# EAGLE board console-ifc (EAGLE 7.6.0)
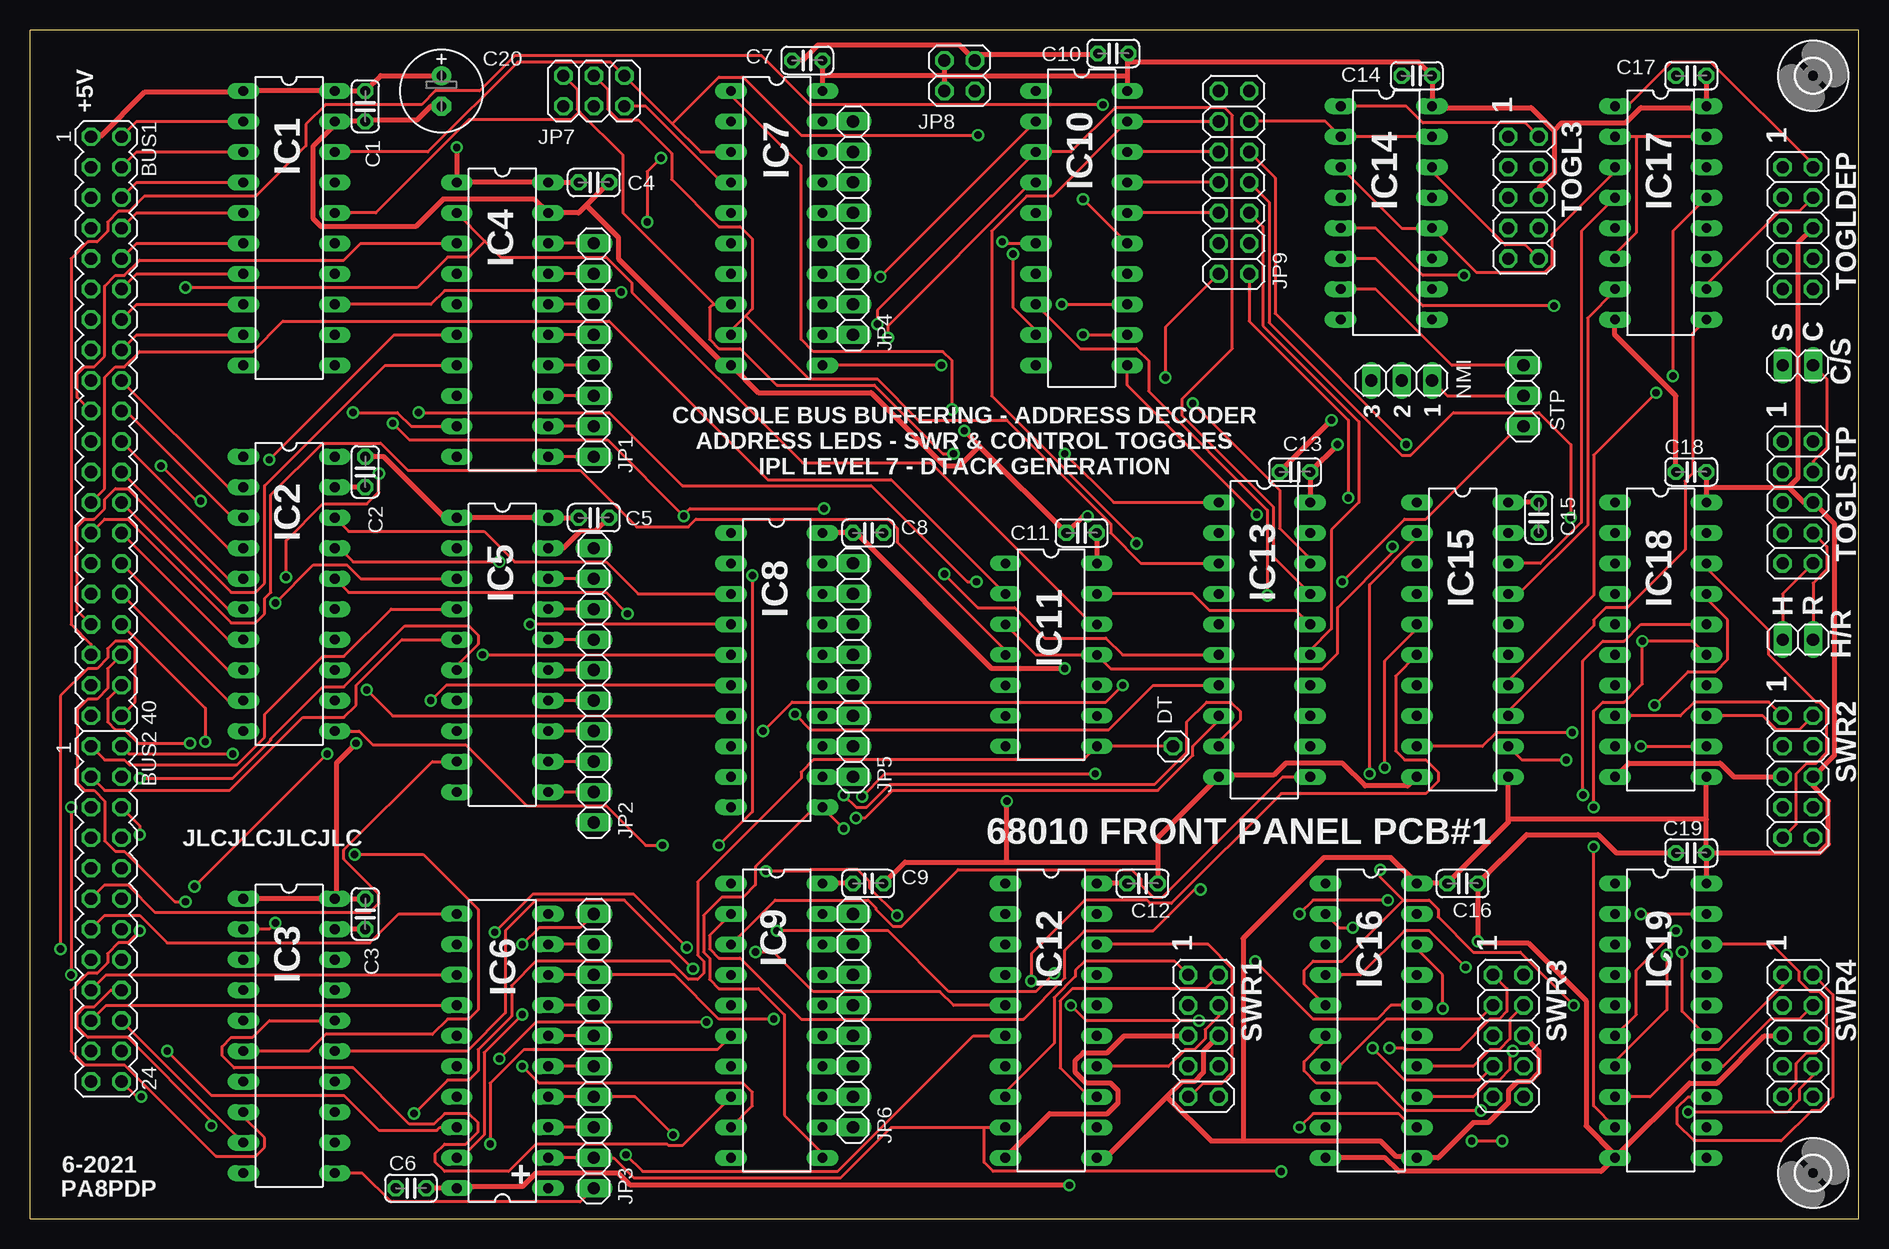
[diagram p4: board, top side]
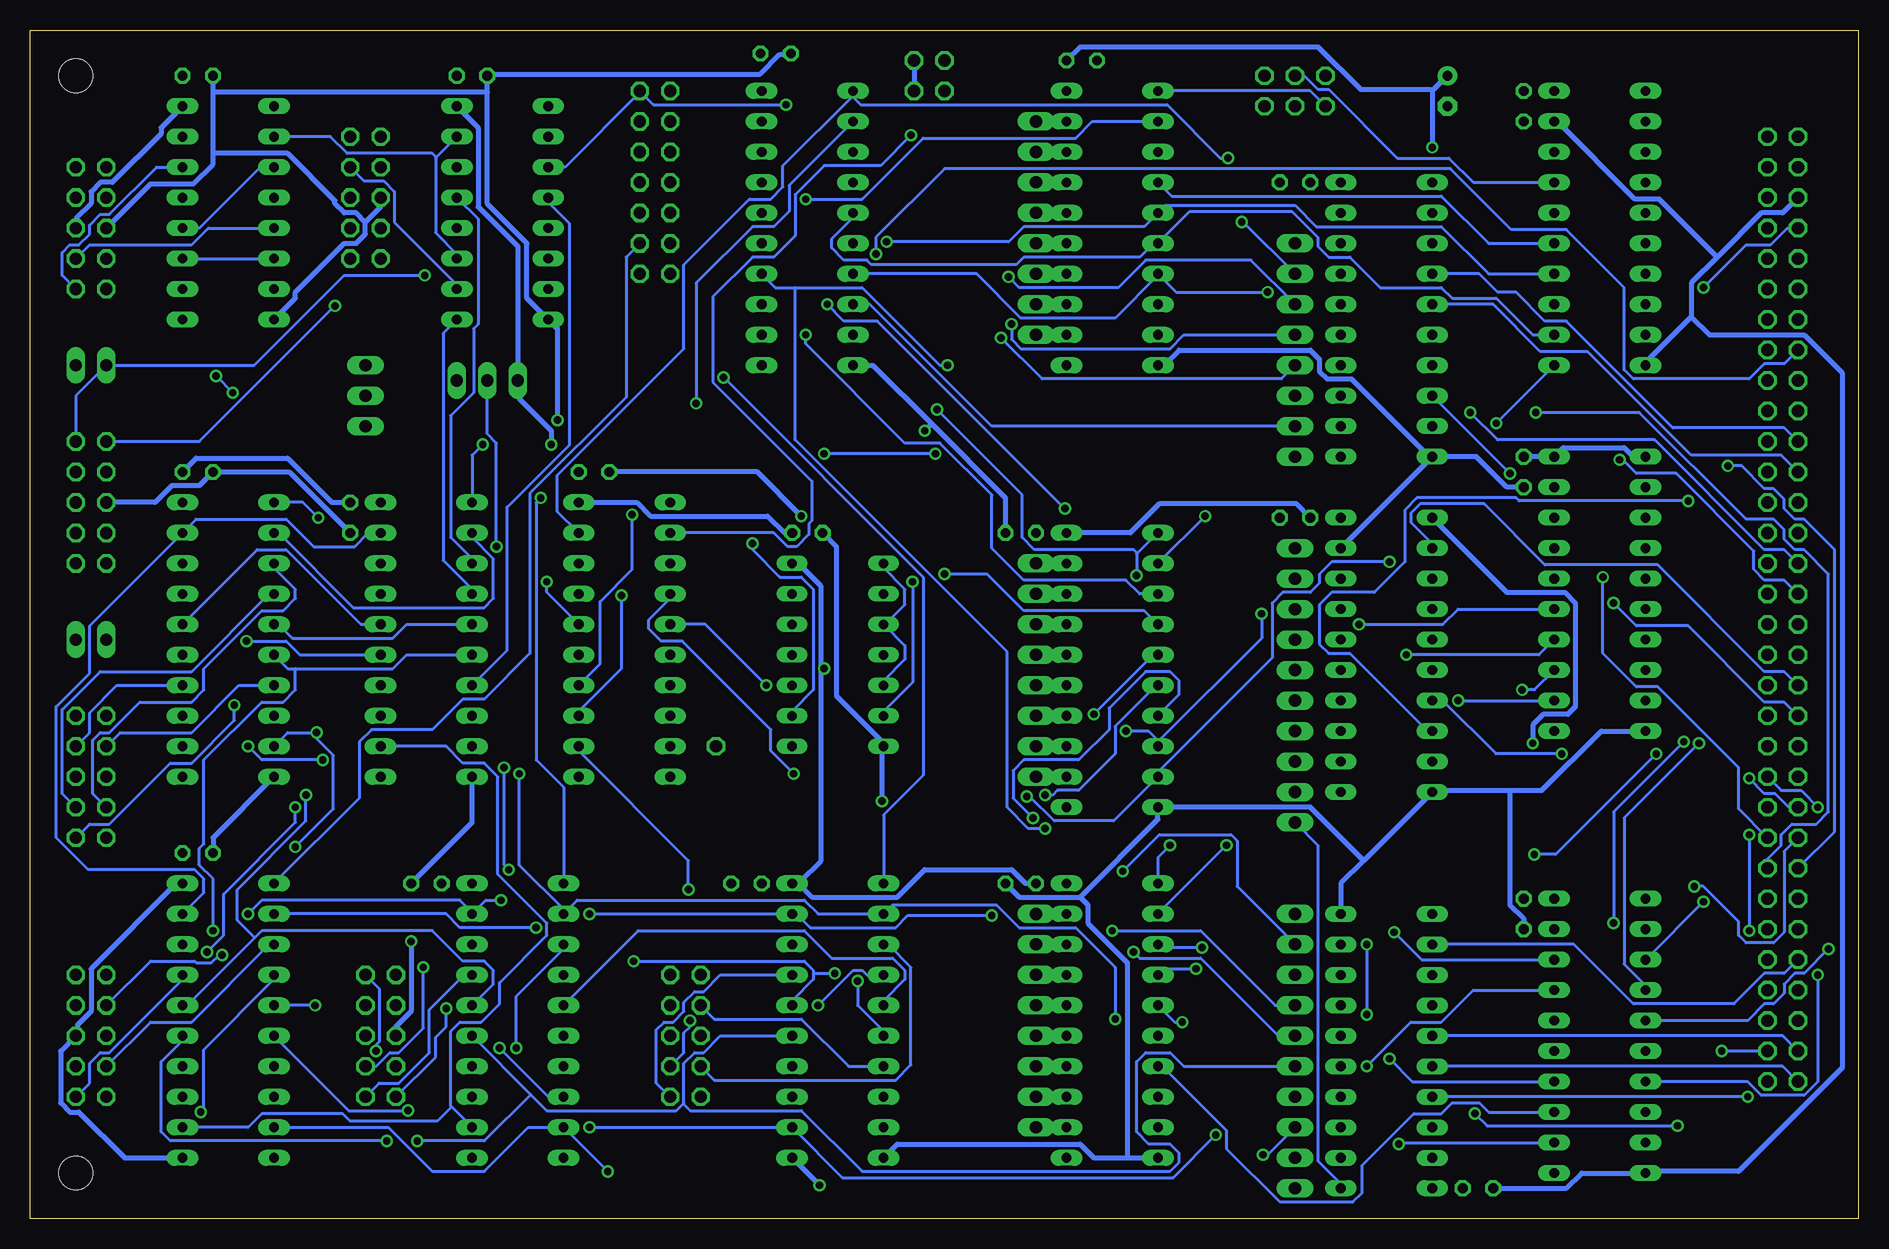
[diagram p5: board, bottom side, seen from below]

Size 152.41 x 99.06 mm. Coordinates in mm from the lower left corner, seen from the top.
Outline: 0,0 152.41,0.01
Outline: 0,0 0,99.06 152.4,99.06 152.4,0
Copper layers (1*16): Top 0.035mm / dielectric 1.5mm / Bottom 0.035mm
Design rules "default": minimum track width 10mil, minimum drill 24mil, track to track 8mil, track to pad 8mil, pad to pad 8mil, via to via 8mil, smd to smd 8mil, copper to edge 40mil, drill to drill 8mil, minimum pad ring 10mil, minimum via ring 8mil, stop-mask expansion 4mil, vias tented up to drill 0mil, thermal gap 10mil
Net classes: 0 default: width 0.203 mm, drill 0.203 mm, clearance 0.203 mm; 1 Power: width 0.406 mm, drill 0.254 mm, clearance 0.254 mm

## Footprints (pad centres in the part's own frame; a part is rotated, then mirrored left to right if it is on the bottom)
MA20-2 = drill 1.016 octagon: 1 -24.13,-1.27; 2 -24.13,1.27; 3 -21.59,-1.27; 4 -21.59,1.27; 5 -19.05,-1.27; 6 -19.05,1.27; 7 -16.51,-1.27; 8 -16.51,1.27; 9 -13.97,-1.27; 10 -13.97,1.27; 11 -11.43,-1.27; 12 -11.43,1.27; 13 -8.89,-1.27; 14 -8.89,1.27; 15 -6.35,-1.27; 16 -6.35,1.27; 17 -3.81,-1.27; 18 -3.81,1.27; 19 -1.27,-1.27; 20 -1.27,1.27; 21 1.27,-1.27; 22 1.27,1.27; 23 3.81,-1.27; 24 3.81,1.27; 25 6.35,-1.27; 26 6.35,1.27; 27 8.89,-1.27; 28 8.89,1.27; 29 11.43,-1.27; 30 11.43,1.27; 31 13.97,-1.27; 32 13.97,1.27; 33 16.51,-1.27; 34 16.51,1.27; 35 19.05,-1.27; 36 19.05,1.27; 37 21.59,-1.27; 38 21.59,1.27; 39 24.13,-1.27; 40 24.13,1.27
MA12-2 = drill 1.016 octagon: 1 -13.97,-1.27; 2 -13.97,1.27; 3 -11.43,-1.27; 4 -11.43,1.27; 5 -8.89,-1.27; 6 -8.89,1.27; 7 -6.35,-1.27; 8 -6.35,1.27; 9 -3.81,-1.27; 10 -3.81,1.27; 11 -1.27,-1.27; 12 -1.27,1.27; 13 1.27,-1.27; 14 1.27,1.27; 15 3.81,-1.27; 16 3.81,1.27; 17 6.35,-1.27; 18 6.35,1.27; 19 8.89,-1.27; 20 8.89,1.27; 21 11.43,-1.27; 22 11.43,1.27; 23 13.97,-1.27; 24 13.97,1.27
C025-024X044 = drill 0.813 octagon: 1 -1.27,0; 2 1.27,0
E2,5-7 = drill 0.813 pad 1.6: + -1.27,0 | drill 0.813 pad 1.6 octagon: - 1.27,0
1X02 = drill 1.016 long: 1 -1.27,0; 2 1.27,0
1X01 = drill 1.016 octagon: 1 0,0
2,8 = hole 2.8: 0,0
DIL20 = drill 0.813 long: 1 -11.43,-3.81; 2 -8.89,-3.81; 3 -6.35,-3.81; 4 -3.81,-3.81; 5 -1.27,-3.81; 6 1.27,-3.81; 7 3.81,-3.81; 8 6.35,-3.81; 9 8.89,-3.81; 10 11.43,-3.81; 11 11.43,3.81; 12 8.89,3.81; 13 6.35,3.81; 14 3.81,3.81; 15 1.27,3.81; 16 -1.27,3.81; 17 -3.81,3.81; 18 -6.35,3.81; 19 -8.89,3.81; 20 -11.43,3.81
DIL14 = drill 0.8 long: 1 -7.62,-3.81; 2 -5.08,-3.81; 3 -2.54,-3.81; 4 0,-3.81; 5 2.54,-3.81; 6 5.08,-3.81; 7 7.62,-3.81; 8 7.62,3.81; 9 5.08,3.81; 10 2.54,3.81; 11 0,3.81; 12 -2.54,3.81; 13 -5.08,3.81; 14 -7.62,3.81
DIL16 = drill 0.813 long: 1 -8.89,-3.81; 2 -6.35,-3.81; 3 -3.81,-3.81; 4 -1.27,-3.81; 5 1.27,-3.81; 6 3.81,-3.81; 7 6.35,-3.81; 8 8.89,-3.81; 9 8.89,3.81; 10 6.35,3.81; 11 3.81,3.81; 12 1.27,3.81; 13 -1.27,3.81; 14 -3.81,3.81; 15 -6.35,3.81; 16 -8.89,3.81
1X08 = drill 1.016 long: 1 -8.89,0; 2 -6.35,0; 3 -3.81,0; 4 -1.27,0; 5 1.27,0; 6 3.81,0; 7 6.35,0; 8 8.89,0
1X10 = drill 1.016 long: 1 -11.43,0; 2 -8.89,0; 3 -6.35,0; 4 -3.81,0; 5 -1.27,0; 6 1.27,0; 7 3.81,0; 8 6.35,0; 9 8.89,0; 10 11.43,0
2X03 = drill 1.016 octagon: 1 -2.54,-1.27; 2 -2.54,1.27; 3 0,-1.27; 4 0,1.27; 5 2.54,-1.27; 6 2.54,1.27
2X02 = drill 1.016 octagon: 1 -1.27,-1.27; 2 -1.27,1.27; 3 1.27,-1.27; 4 1.27,1.27
2X07 = drill 1.016 octagon: 1 -7.62,-1.27; 2 -7.62,1.27; 3 -5.08,-1.27; 4 -5.08,1.27; 5 -2.54,-1.27; 6 -2.54,1.27; 7 0,-1.27; 8 0,1.27; 9 2.54,-1.27; 10 2.54,1.27; 11 5.08,-1.27; 12 5.08,1.27; 13 7.62,-1.27; 14 7.62,1.27
1X03 = drill 1.016 long: 1 -2.54,0; 2 0,0; 3 2.54,0
2X05 = drill 1.016 octagon: 1 -5.08,-1.27; 2 -5.08,1.27; 3 -2.54,-1.27; 4 -2.54,1.27; 5 0,-1.27; 6 0,1.27; 7 2.54,-1.27; 8 2.54,1.27; 9 5.08,-1.27; 10 5.08,1.27

## Placement (x,y rotation side)
BUS1  BUS1  [MA20-2]  6.35,66.04 270 top
BUS2  BUS2  [MA12-2]  6.35,25.4 270 top
C1  100n  [C025-024X044]  27.94,92.71 270 top
C2  100n  [C025-024X044]  27.94,62.23 270 top
C3  100n  [C025-024X044]  27.94,25.4 270 top
C4  100n  [C025-024X044]  46.99,86.36 0 top
C5  100n  [C025-024X044]  46.99,58.42 0 top
C6  100n  [C025-024X044]  31.75,2.54 180 top
C7  100n  [C025-024X044]  64.77,96.52 180 top
C8  100n  [C025-024X044]  69.85,57.15 0 top
C9  100n  [C025-024X044]  69.85,27.94 0 top
C10  220n  [C025-024X044]  90.27,97.1 180 top
C11  100n  [C025-024X044]  87.63,57.15 180 top
C12  100n  [C025-024X044]  92.71,27.94 0 top
C13  220n  [C025-024X044]  105.41,62.23 180 top
C14  100n  [C025-024X044]  115.57,95.25 180 top
C15  100n  [C025-024X044]  125.73,58.42 270 top
C16  100n  [C025-024X044]  119.38,27.94 0 top
C17  100n  [C025-024X044]  138.43,95.25 180 top
C18  100n  [C025-024X044]  138.43,62.23 180 top
C19  100n  [C025-024X044]  138.43,30.48 180 top
C20  470µF  [E2,5-7]  34.29,93.98 270 top
C/S  C/S  [1X02]  147.32,71.12 180 top
DT  DT  [1X01]  95.25,39.37 0 top
H1  MOUNT-HOLE2.8  [2,8]  148.59,3.81 0 top
H4  MOUNT-HOLE2.8  [2,8]  148.59,95.25 0 top
H/R  H/R  [1X02]  147.32,48.26 0 top
IC1  74LS245N  [DIL20]  21.59,82.55 270 top
IC2  74LS245N  [DIL20]  21.59,52.07 270 top
IC3  74LS245N  [DIL20]  21.59,15.24 270 top
IC4  74LS245N  [DIL20]  39.37,74.93 270 top
IC5  74LS245N  [DIL20]  39.37,46.99 270 top
IC6  74LS245N  [DIL20]  39.37,13.97 90 top
IC7  74HCT574N  [DIL20]  62.23,82.55 270 top
IC8  74HCT574N  [DIL20]  62.23,45.72 270 top
IC9  74HCT574N  [DIL20]  62.23,16.51 270 top
IC10  ATF16V8BP3  [DIL20]  87.63,82.55 270 top
IC11  74LS07N  [DIL14]  85.09,46.99 270 top
IC12  74LS373N  [DIL20]  85.09,16.51 270 top
IC13  ATF16V8BP3  [DIL20]  102.87,48.26 270 top
IC14  74LS279N  [DIL16]  113.03,83.82 270 top
IC15  74LS373N  [DIL20]  119.38,48.26 270 top
IC16  74LS373N  [DIL20]  111.76,16.51 270 top
IC17  74LS279N  [DIL16]  135.89,83.82 270 top
IC18  74LS373N  [DIL20]  135.89,48.26 270 top
IC19  74LS373N  [DIL20]  135.89,16.51 270 top
JP1  JP1  [1X08]  46.99,72.39 90 top
JP2  JP2  [1X10]  46.99,44.45 90 top
JP3  JP3  [1X10]  46.99,13.97 90 top
JP4  JP4  [1X08]  68.58,82.55 90 top
JP5  JP5  [1X08]  68.58,45.72 90 top
JP6  JP6  [1X08]  68.58,16.51 90 top
JP7  JP7  [2X03]  46.99,93.98 0 top
JP8  JP8  [2X02]  77.47,95.25 90 top
JP9  JP9  [2X07]  100.33,86.36 90 top
NMI  NMI  [1X03]  114.3,69.85 180 top
STP  STP  [1X03]  124.46,68.58 90 top
SWR1  SWR1  [2X05]  97.79,15.24 270 top
SWR2  SWR2  [2X05]  147.32,36.83 270 top
SWR3  SWR3  [2X05]  123.19,15.24 270 top
SWR4  SWR4  [2X05]  147.32,15.24 270 top
TOGL3  TOGL3  [2X05]  124.46,85.09 270 top
TOGLDEP  TOGLDEP  [2X05]  147.32,82.55 270 top
TOGLSTP  TOGLSTP  [2X05]  147.32,59.69 270 top

## Tracks (layer width: path | path; a pad name or v marks a point on that pad's centre or on a via)
!AS  (via drill 0.61)
  Top 0.254: v29.08,62.1 29.08,60.58 28.07,59.56 24.38,59.56 21.34,56.52 v21.34,53.47
  Bottom 0.254: v29.08,62.1 IC4.8 | v21.34,53.47 21.34,47.12 18.54,44.32 16.76,44.32 10.03,37.59 10.03,34.16 BUS2.8
!ASB  (via drill 0.61)
  Top 0.254: JP1.2 IC4.12 | v103.12,51.94 103.12,59.05 93.22,68.96 93.22,71.5 92.2,72.52 87.5,72.52 IC10.8
  Bottom 0.254: IC10.8 82.42,76.2 72.26,66.04 JP1.2 | IC13.13 106.68,42.29 103.12,45.85 v103.12,51.94
!BERR  (via drill 0.61)
  Top 0.254: IC4.9 31.75,66.04 30.61,67.18 v26.92,67.18
  Bottom 0.254: v26.92,67.18 18.29,67.18 9.4,58.29 7.11,58.29 6.22,57.4 6.22,56.64 5.33,55.75 4.57,55.75 2.54,53.72 2.54,33.91 3.56,32.89 5.59,32.89 6.48,32 6.48,31.11 7.62,29.97 BUS2.10
!BERRB
  Top 0.254: JP1.1 IC4.11
!CLRTOGGL
  Top 0.254: IC17.15 133.86,90.17 | 133.86,90.17 IC17.2 | IC17.6 132.08,80.39 133.86,82.17 133.86,90.17 | IC14.15 IC14.2 107.95,91.44 JP9.11
  Bottom 0.254: IC17.11 IC17.6 | IC14.11 116.84,80.39 118.62,82.17 118.62,88.39 118.56,88.46 | IC14.15 118.56,88.46 | IC17.2 127.38,90.17 125.98,88.77 118.87,88.77 118.56,88.46
!CONSEL  (via drill 0.61)
  Top 0.254: v92.2,56.26 92.2,56.52 80.14,68.58 80.14,82.3 83.06,85.22 85.22,85.22 IC10.19 JP9.12
  Bottom 0.254: IC11.9 88.9,42.29 87.12,44.07 87.12,52.45 88.14,53.47 89.92,53.47 92.2,55.75 v92.2,56.26
!CPUOUT  (via drill 0.61)
  Top 0.254: v57.4,31.11 60.2,33.91 v60.2,53.59 | IC7.1 58.42,93.6 64.26,87.76 64.26,73.28 65.28,72.26 76.07,72.26 76.83,71.5 v76.83,67.44
  Bottom 0.254: IC7.1 45.72,93.98 JP7.1 | IC9.1 58.42,30.1 v57.4,31.11 | v60.2,53.59 60.2,55.37 60.13,55.44 | IC8.1 60.13,55.44 | v76.83,67.44 69.72,60.33 69.72,56.77 68.71,55.75 60.45,55.75 60.13,55.44
!DATA0DIR
  Bottom 0.254: IC6.1 43.18,2.92 45.09,4.83 45.09,31.11 JP2.1
!DATA0ENA  (via drill 0.61)
  Top 0.254: IC6.19 35.94,5.08 37.85,6.99 37.85,13.84 v41.02,17.02 | v41.02,22.86 42.42,24.26 45.85,24.26 JP3.10
  Bottom 0.254: v41.02,22.86 v41.02,17.02
!DTACK  (via drill 0.61)
  Top 0.254: DT.1 IC11.8 87.76,38.23 65.28,38.23 64.26,37.21 64.26,36.7 55.63,28.07 55.63,21.97 56.13,21.46 56.13,20.45 55.63,19.94 54.86,19.94 53.34,21.46 42.16,21.46 40.13,19.43 40.13,16.89 37.34,14.1 37.34,12.32 36.58,11.56 34.8,11.56 v32,8.76 | BUS2.18 6.73,19.05 5.33,17.65 4.57,17.65 3.94,17.02 3.94,16 4.83,15.11 8.13,15.11 15.11,8.13 v15.11,7.75
  Bottom 0.254: v15.11,7.75 30.99,7.75 v32,8.76
!IAC
  Top 0.254: JP9.6 IC10.16
!IACK7  (via drill 0.61)
  Top 0.254: IC11.13 96.9,52.07 98.3,50.67 105.54,50.67 IC13.16 | STP.1 124.08,66.04 116.33,58.29 114.55,58.29 v109.35,53.09
  Bottom 0.254: v109.35,53.09 109.35,52.2 IC13.16
!IOSEL  (via drill 0.61)
  Top 0.254: IC10.9 83.82,74.04 81.92,75.95 v81.92,80.39
  Bottom 0.254: v81.92,80.39 81.92,81.79 76.2,87.5 34.04,87.5 28.96,82.42 24.38,82.42 19.56,77.6 19.56,70.74 18.8,69.98 9.14,69.98 7.87,71.25 6.22,71.25 BUS1.15
!IPL0
  Top 0.254: IC11.2 71.75,61.59 61.47,61.59 48.26,74.8 21.08,74.8 18.54,72.26 9.14,72.26 7.87,70.99 7.11,70.99 6.22,70.1 6.22,60.83 BUS1.25
!IPL1
  Top 0.254: IC11.4 81.28,47.37 72.26,56.39 72.26,57.53 71.5,58.29 55.5,58.29 54.86,57.66 50.55,57.66 45.85,62.36 31.5,62.36 29.21,64.64 24.38,64.64 20.07,60.33 20.07,52.2 19.56,51.69 19.56,50.42 18.8,49.66 16.76,49.66 8.13,58.29 6.22,58.29 BUS1.27
!IPL2  (via drill 0.61)
  Top 0.254: v78.87,53.09 78.11,53.09 70.1,61.09 54.36,61.09 48.26,67.18 v32.38,67.18
  Bottom 0.254: IC11.6 81.28,42.29 78.87,44.7 v78.87,53.09 | v32.38,67.18 30.1,64.9 17.02,64.9 7.87,55.75 6.22,55.75 BUS1.29
!LDS  (via drill 0.61)
  Top 0.254: IC4.6 30.35,73.66 v19.94,63.25
  Bottom 0.254: v19.94,63.25 19.68,63.25 18.54,62.1 15.24,62.1 8.76,55.63 8.76,54.1 7.87,53.21 6.22,53.21 BUS1.31
!LDSB  (via drill 0.61)
  Top 0.254: JP1.4 IC4.14 | IC10.4 83.44,86.36 71.5,74.42 v71.5,73.41
  Bottom 0.254: v71.5,73.41 68.07,69.98 48.13,69.98 JP1.4
!LEVEL7
  Top 0.254: STP.2 118.11,68.58 NMI.1
!RDSWR00  (via drill 0.61)
  Top 0.254: v94.61,70.1 94.61,74.3 JP9.2
  Bottom 0.254: IC12.1 81.28,33.66 77.98,36.96 77.98,53.47 v94.61,70.1
!RDSWR08  (via drill 0.61)
  Top 0.254: v128.4,58.42 128.4,64.52 125.73,67.18 118.62,67.18 115.06,63.63 114.3,63.63 103.25,74.68 103.25,84.71 JP9.7
  Bottom 0.254: IC18.1 129.67,59.69 v128.4,58.42
!RDSWR16  (via drill 0.61)
  Top 0.254: v109.86,60.07 109.86,66.55 101.6,74.8 JP9.1
  Bottom 0.254: IC16.1 107.95,35.94 110.24,38.23 110.24,59.69 v109.86,60.07
!RDSWR24
  Bottom 0.254: IC19.1 124.97,35.05 124.97,39.75 123.95,40.77 118.87,40.77 116.33,43.31 114.55,43.31 110.74,47.12 110.74,60.45 102.74,68.45 102.74,80.14 JP9.3
!RDTOGGL  (via drill 0.61)
  Top 0.254: v114.68,64.52 103.76,75.44 103.76,86.74 JP9.9
  Bottom 0.254: IC15.1 115.57,63.63 v114.68,64.52
!RESET  (via drill 0.61)
  Top 0.254: IC14.3 114.3,82.55 IC14.12 120.52,78.87 126.24,78.87 126.87,79.5 126.87,82.04 132.08,87.25 IC17.3 | BUS1.35 5.08,47.88 3.43,49.53 3.43,80.01 4.83,81.41 5.59,81.41 6.48,82.3 6.48,83.06 7.37,83.95 8.26,83.95 9.53,85.22 18.8,85.22 22.99,89.41 22.99,91.19 24.64,92.84 32.64,92.84 33.78,93.98 37.47,93.98 40.39,96.9 60.96,96.9 65.02,92.84 v89.41,92.84
  Bottom 0.254: IC17.12 138.3,82.55 133.22,87.63 IC17.3 | v89.41,92.84 100.46,92.84 JP9.13 101.6,93.85 107.82,87.63 IC14.3
!SUP
  Top 0.254: JP9.10 IC10.18
!UDS
  Top 0.254: IC4.7 29.59,71.12 19.56,61.09 19.56,52.96 18.8,52.2 16.76,52.2 8.13,60.83 7.11,60.83 6.22,59.94 6.22,59.18 5.33,58.29 4.57,58.29 3.94,57.66 3.94,50.67 BUS1.33
!UDSB
  Top 0.254: JP1.3 IC4.13
!USR
  Top 0.254: JP9.8 IC10.17
!VPA  (via drill 0.61)
  Top 0.254: IC11.12 88.52,49.53 75.06,62.99 64.39,62.99 50.16,77.22 50.16,77.98 48.01,80.14 39.24,80.14 37.91,81.47 | IC4.2 37.91,81.47 | v12.95,77.6 32.26,77.6 34.8,80.14 36.58,80.14 37.91,81.47
  Bottom 0.254: BUS1.7 5.97,82.55 7.37,81.15 9.4,81.15 v12.95,77.6
!VPAB
  Top 0.254: JP1.8 IC4.18
A1
  Top 0.254: IC1.2 8.89,91.44 BUS1.2
A1B  (via drill 0.61)
  Top 0.254: IC1.18 33.15,88.9 40.64,96.39 48.39,96.39 JP7.6 53.53,91.25 | IC7.3 55.88,88.9 53.53,91.25 | v78.99,90.3 64.26,90.3 59.44,95.12 57.4,95.12 53.53,91.25
  Bottom 0.254: IC13.2 90.42,57.15 89.28,56.01 88.52,56.01 87.5,57.02 87.5,57.91 87.25,58.17 87.25,61.47 95.5,69.72 95.5,76.83 92.2,80.14 90.42,80.14 88.65,81.92 88.65,85.34 86.23,87.76 81.53,87.76 v78.99,90.3
A2
  Top 0.254: IC1.3 8.89,88.9 BUS1.4
A2B
  Top 0.254: IC7.9 58.42,74.04 59.63,75.25 | 59.63,75.25 60.2,75.82 60.2,81.66 59.18,82.68 57.4,82.68 53.47,86.61 53.47,88.77 50.67,91.57 49.02,91.57 48.13,92.46 48.13,94.11 JP7.4 | IC13.3 92.58,54.61 90.04,57.15 90.04,57.91 81.41,66.55 74.04,66.55 70.61,69.98 64.9,69.98 59.63,75.25
  Bottom 0.254: IC1.17 32.13,86.36 34.16,88.39 38.48,88.39 44.2,94.11 45.09,94.11 46.23,95.25 JP7.4
A3
  Top 0.254: IC1.4 8.89,86.36 BUS1.6
A3B  (via drill 0.61)
  Top 0.254: IC7.8 57.02,76.2 56.96,76.26 | 56.96,76.26 49.4,83.82 49.4,88.65 45.78,92.27 | 45.78,92.27 45.59,92.46 45.59,94.11 JP7.2 | IC13.1 90.3,59.69 v86.23,63.75 | v76.96,63.75 76.07,63.75 70.36,69.47 62.23,69.47 59.18,72.52 57.4,72.52 56.64,73.28 56.64,75.95 56.96,76.26 | IC1.16 28.83,83.82 36.58,91.57 45.09,91.57 45.78,92.27
  Bottom 0.254: v76.96,63.75 v86.23,63.75
A4
  Top 0.254: IC1.5 8.89,83.82 BUS1.8
A4B
  Top 0.254: JP7.5 51.31,92.71 57.66,86.36 IC7.4
  Bottom 0.254: IC1.15 30.86,81.28 34.8,85.22 57.28,85.22 IC7.4
A5
  Top 0.254: IC1.6 8.89,81.28 BUS1.10
A5B  (via drill 0.61)
  Top 0.254: IC10.6 81.15,81.28 v81.03,81.41
  Bottom 0.254: IC1.14 30.86,78.74 34.8,82.68 45.21,82.68 46.99,84.45 57.78,84.45 IC7.5 59.56,82.68 69.6,82.68 70.87,81.41 v81.03,81.41
A6
  Top 0.254: IC1.7 8.89,78.74 BUS1.12
A6B  (via drill 0.61)
  Top 0.254: IC1.13 33.4,76.2 34.54,77.34 49.15,77.34 v49.28,77.22
  Bottom 0.254: v49.28,77.22 56.9,77.22 IC7.7 58.42,78.61 61.98,75.06 69.85,75.06 73.53,78.74 IC10.7
A7
  Top 0.254: IC1.8 8.89,76.2 BUS1.14
A7B
  Bottom 0.254: IC1.12 27.18,73.66 30.23,76.71 33.91,76.71 34.8,77.6 39.88,77.6 42.42,80.14 44.2,80.14 45.09,81.03 45.09,81.79 47.24,83.95 55.75,83.95 IC7.6 58.8,81.28 59.94,80.14 69.6,80.14 70.23,79.5 82.3,79.5 82.68,79.88 84.58,79.88 85.6,80.9 85.6,81.66 83.82,83.44 IC10.5
A8
  Top 0.254: IC1.9 8.89,73.66 BUS1.16
A8B  (via drill 0.61)
  Top 0.254: v30.23,66.29 31.62,64.9 48.13,64.9 v54.48,58.55 54.48,58.67 54.99,59.18 v66.17,59.18 | v85.98,76.2 IC10.13
  Bottom 0.254: v54.48,58.55 IC8.2 | IC1.11 v30.23,66.29 | v85.98,76.2 84.58,74.8 81.79,74.8 v66.17,59.18
A9
  Top 0.254: IC2.2 16.51,60.96 BUS1.18
A9B  (via drill 0.61)
  Top 0.254: IC8.3 50.67,52.07 48.01,54.74 40.39,54.74 37.85,57.28 26.54,57.28 IC2.18 | v87.76,73.66 IC10.12
  Bottom 0.254: v87.76,73.66 87.76,72.9 79.5,64.64 76.58,64.64 72.26,60.33 72.26,55.88 69.6,53.21 61.09,53.21 59.94,52.07 IC8.3
A10
  Top 0.254: IC2.3 16.89,58.42 8,67.31 BUS1.20
A10B  (via drill 0.61)
  Top 0.254: v39.12,54.74 26.92,54.74 25.78,55.88 IC2.17 | v88.77,37.08 71.25,37.08 v69.34,35.18
  Bottom 0.254: v39.12,54.74 43.94,54.74 44.96,53.72 44.96,52.96 45.72,52.2 48.01,52.2 48.9,51.31 48.9,46.74 58.42,37.21 IC8.9 62.1,33.15 67.06,33.15 69.09,35.18 v69.34,35.18 | IC13.4 99.06,51.69 100.84,49.91 100.84,49.15 99.82,48.13 98.04,48.13 90.68,40.77 90.68,38.99 v88.77,37.08
A11
  Top 0.254: IC2.4 16.51,55.88 BUS1.22
A11B  (via drill 0.61)
  Top 0.254: v49.78,50.42 48.01,52.2 26.54,52.2 IC2.16 | v91.06,44.45 89.66,43.05 63.5,43.05 v61.09,40.64
  Bottom 0.254: v49.78,50.42 49.78,48.39 58.42,39.75 IC8.8 58.42,39.88 59.18,40.64 v61.09,40.64 | IC13.5 96.14,49.53 v91.06,44.45
A12
  Top 0.254: IC2.5 16.51,53.34 BUS1.24
A12B  (via drill 0.61)
  Top 0.254: IC8.4 v41.66,49.53 | IC13.6 91.06,46.99 89.66,48.39 84.58,48.39 82.04,50.93 78.99,50.93 v76.2,53.72
  Bottom 0.254: IC2.15 33.4,50.8 34.67,49.53 v41.66,49.53 | v76.2,53.72 72.64,53.72 69.6,50.67 59.56,50.67 IC8.4
A13
  Top 0.254: IC2.6 16.51,50.8 BUS1.26
A13B  (via drill 0.61)
  Top 0.254: v37.72,46.99 IC8.5 | IC13.7 93.6,44.45 89.92,40.77 65.02,40.77 v63.75,42.04
  Bottom 0.254: v37.72,46.99 26.67,46.99 IC2.14 | v63.75,42.04 58.8,46.99 IC8.5
A14
  Top 0.254: IC2.7 16.51,48.26 BUS1.28
A14B  (via drill 0.61)
  Top 0.254: IC8.7 30.23,41.91 v28.07,44.07 | IC13.8 99.06,41.53 96.9,39.37 96.9,38.61 93.98,35.69 71.88,35.69 69.6,33.4 v68.83,33.4
  Bottom 0.254: v28.07,44.07 27.05,44.07 IC2.13 | v68.83,33.4 70.48,35.05 70.48,37.34 69.6,38.23 65.02,38.23 62.48,40.77 62.48,42.55 59.44,45.59 57.4,45.59 56.64,44.83 56.64,43.69 IC8.7
A15
  Top 0.254: IC2.8 16.51,45.72 BUS1.30
A15B  (via drill 0.61)
  Top 0.254: IC13.9 99.06,39.75 100.84,41.53 100.84,42.29 100.08,43.05 98.04,43.05 96.39,41.4 96.39,38.86 93.73,36.2 71.63,36.2 69.72,34.29 68.83,34.29 v67.82,35.31 | v33.4,43.18 34.67,44.45 IC8.6
  Bottom 0.254: v67.82,35.31 67.18,35.31 66.8,35.69 65.02,35.69 61.98,38.73 61.98,41.02 58.55,44.45 IC8.6 | v33.4,43.18 IC2.12
A16
  Top 0.254: IC2.9 16.51,43.18 BUS1.32
A16B  (via drill 0.61)
  Top 0.254: v52.7,31.11 51.31,31.11 48.01,34.42 41.4,34.42 36.32,39.5 28.57,39.5 27.43,40.64 IC2.11 | v97.54,27.43 97.03,27.43 93.6,24 87.88,24 86.23,22.35 86.23,20.07 82.8,16.64 64.26,16.64 59.18,21.72 57.4,21.72 56.64,22.48 56.64,23.62 IC9.2
  Bottom 0.254: v52.7,31.11 IC9.2 | IC13.12 106.68,38.99 97.54,29.84 v97.54,27.43
A17  (via drill 0.61)
  Top 0.254: IC3.2 19.94,24.13 v20.45,24.64 | v14.61,39.75 14.61,42.55 BUS1.34
  Bottom 0.254: v20.45,24.64 20.45,33.91 v14.61,39.75
A17B  (via drill 0.61)
  Top 0.254: v38.73,23.88 41.91,27.05 50.29,27.05 v54.74,22.61 | IC13.11 104.39,36.83 94.36,26.8 93.6,26.8 92.58,27.81 92.58,28.32 91.82,29.08 77.34,29.08 72.64,24.38 71.88,24.38 70.48,25.78 70.48,25.91 69.85,26.54 62.1,26.54 IC9.3
  Bottom 0.254: IC3.18 36.45,21.59 v38.73,23.88 | v54.74,22.61 58.17,22.61 IC9.3
A18  (via drill 0.61)
  Top 0.254: v12.95,26.42 12.06,26.42 7.87,30.61 7.11,30.61 6.22,31.5 6.22,34.8 5.33,35.69 4.57,35.69 3.94,36.32 3.94,42.42 4.83,43.31 5.59,43.31 6.48,44.2 6.48,45.85 BUS1.36
  Bottom 0.254: v12.95,26.42 IC3.3
A18B  (via drill 0.61)
  Top 0.254: v41.02,12.7 42.42,11.3 59.44,11.3 60.2,10.54 60.2,9.4 IC9.9
  Bottom 0.254: IC3.17 32.13,19.05 34.8,16.38 37.34,16.38 v41.02,12.7
A19  (via drill 0.61)
  Top 0.254: v13.34,39.62 9.02,39.62 7.87,40.77 7.11,40.77 6.48,41.4 6.48,43.31 BUS1.38
  Bottom 0.254: IC3.4 17.78,19.43 19.56,21.21 19.56,33.4 v13.34,39.62
A19B
  Top 0.254: IC3.16 19.94,16.51 18.54,15.11 16.76,15.11 16,14.35 16,13.59 17.02,12.57 26.92,12.57 31.62,7.87 33.66,7.87 34.54,8.76 36.58,8.76 37.34,8 37.34,7.24 36.32,6.22 34.54,6.22 33.78,5.46 33.78,4.7 34.54,3.94 39.88,3.94 42.16,6.22 53.09,6.22 53.21,6.1 54.36,6.1 IC9.8
A20  (via drill 0.61)
  Top 0.254: v2.54,22.48 2.54,43.56 4.83,45.85 5.59,45.85 6.48,46.74 6.48,47.5 7.11,48.13 8.13,48.13 8.76,47.5 8.76,43.05 BUS1.40
  Bottom 0.254: IC3.5 9.27,16.51 7.87,17.91 7.11,17.91 6.22,18.8 6.22,19.56 5.33,20.45 4.57,20.45 v2.54,22.48
A20B  (via drill 0.61)
  Top 0.254: IC3.15 36.45,13.97 39.62,17.14 39.62,24 42.16,26.54 49.53,26.54 v55.24,20.83
  Bottom 0.254: v55.24,20.83 57.91,20.83 IC9.4
A21  (via drill 0.61)
  Top 0.254: IC3.6 23.24,13.97 24.64,15.37 33.53,15.37 34.8,16.64 36.58,16.64 37.34,17.4 37.34,25.78 32.77,30.35 v27.05,30.35 | v16.89,38.73 8.26,38.73 BUS2.2
  Bottom 0.254: v27.05,30.35 25.27,30.35 v16.89,38.73
A21B  (via drill 0.61)
  Top 0.254: v39.12,13.34 42.16,16.38 v56.39,16.38
  Bottom 0.254: IC3.14 37.21,11.43 v39.12,13.34 | v56.39,16.38 57.02,16.38 IC9.5
A22  (via drill 0.61)
  Top 0.254: v3.43,34.29 v3.43,20.32
  Bottom 0.254: IC3.7 9.27,11.43 8.13,10.29 4.57,10.29 3.43,11.43 v3.43,20.32 | v3.43,34.29 4.83,35.69 6.48,35.69 BUS2.4
A22B
  Bottom 0.254: IC3.13 30.86,8.89 31.62,9.65 33.91,9.65 34.8,8.76 37.08,8.76 41.4,4.45 41.4,2.16 42.16,1.4 48.26,1.4 52.7,5.84 52.7,7.37 58.04,12.7 IC9.7
A23  (via drill 0.61)
  Top 0.254: IC3.8 17.78,8.51 19.56,6.73 19.56,5.97 18.8,5.21 15.49,5.21 7.87,12.83 4.57,12.83 3.43,13.97 3.43,19.05 4.83,20.45 5.59,20.45 6.48,21.34 6.48,22.1 7.37,22.99 8.13,22.99 v9.14,24 | v9.14,32 9.14,32.77 BUS2.6
  Bottom 0.254: v9.14,32 v9.14,24
A23B  (via drill 0.61)
  Top 0.254: v38.35,6.22 38.35,11.3 41.15,14.1 57.28,14.1 IC9.6
  Bottom 0.254: IC3.12 38.23,6.35 v38.35,6.22
ASBINV  (via drill 0.61)
  Top 0.254: v75.95,71.12 IC7.11 | IC9.11 66.04,5.46 62.87,8.64 62.87,17.02 60.71,19.18 57.4,19.18 56.64,19.94 56.64,21.72 56.13,22.23 56.13,25.27 57.66,26.8 59.44,26.8 60.45,27.81 60.45,29.34 65.41,34.29 IC8.11 v67.82,32.51
  Bottom 0.254: v75.95,71.12 76.58,71.12 83.06,77.6 88.65,77.6 | 88.65,77.6 90.3,77.6 IC10.14 | 88.65,77.6 88.65,64.9 70.99,47.24 70.99,34.29 69.22,32.51 v67.82,32.51
CONSACT  (via drill 0.61)
  Top 0.254: IC10.11 91.44,69.47 v102.23,58.67
  Bottom 0.254: v102.23,58.67 102.23,54.1 104.9,51.44 104.9,46.23 IC13.14
D0  (via drill 0.61)
  Top 0.254: IC6.18 34.16,7.62 33.91,7.37 29.08,7.37 26.16,10.29 15.11,10.29 v11.43,13.97
  Bottom 0.254: BUS2.22 v11.43,13.97
D0B  (via drill 0.61)
  Top 0.254: IC6.2 JP3.2 48.64,5.08 50.29,3.43 67.56,3.43 71.75,7.62 79.5,7.62 | 79.5,7.62 IC12.9 | IC15.9 121.03,39.37 122.17,40.51 v128.52,40.51 | v130.3,30.99 130.3,9.4 IC19.9 | 79.5,7.62 79.5,4.7 80.26,3.94 v104.27,3.94
  Bottom 0.254: IC18.9 130.94,40.51 v128.52,40.51 128.52,40.01 127.13,38.61 127.13,34.16 v130.3,30.99 | IC19.9 122.56,7.62 118.87,3.94 114.55,3.94 110.87,7.62 IC16.9 v104.27,3.94
D1  (via drill 0.61)
  Top 0.254: v9.27,10.16 8.89,10.16 BUS2.24
  Bottom 0.254: v9.27,10.16 IC6.17
D1B  (via drill 0.61)
  Top 0.254: JP3.3 IC6.3 | IC12.6 78.61,15.24 67.31,3.94 51.05,3.94 v49.66,5.33 | IC16.6 107.95,14.86 106.17,13.08 106.17,12.32 107.19,11.3 112.27,11.3 114.55,9.02 v120.9,9.02 | v137.16,24 133.86,20.7 133.86,17.02 IC19.6 | v83.44,19.81 83.44,22.1 87.88,26.54 93.09,26.54 93.34,26.29 95.12,26.29 104.27,35.43 116.33,35.43 117.35,36.45 117.35,37.21 116.33,38.23 114.55,38.23 113.79,38.99 113.79,45.21 IC15.6
  Bottom 0.254: v49.66,5.33 49.28,5.33 JP3.3 | IC15.6 121.03,46.99 122.17,45.85 130.3,45.85 | 130.3,45.85 130.94,45.85 IC18.6 | v120.9,9.02 125.86,9.02 IC19.6 | 130.3,45.85 130.3,44.07 131.32,43.05 133.1,43.05 137.92,38.23 137.92,31.24 138.3,30.86 138.3,29.46 137.16,28.32 v137.16,24 | IC12.6 81.28,15.62 83.44,17.78 v83.44,19.81
D2
  Bottom 0.254: IC6.16 6.35,12.7 BUS2.23
D2B  (via drill 0.61)
  Top 0.254: IC6.4 JP3.4 50.42,10.16 v53.59,6.99 | v105.79,7.62 106.93,8.76 114.05,8.76 115.19,7.62 IC16.12 | v134.24,39.37 IC18.12 | v128.02,38.23 124.33,38.23 IC15.12
  Bottom 0.254: v105.79,7.62 IC12.12 84.71,3.43 57.15,3.43 v53.59,6.99 | IC15.12 117.73,39.37 116.33,37.97 114.55,37.97 113.41,36.83 113.41,28.7 109.35,24.64 109.35,23.62 113.28,19.68 113.28,17.91 114.81,16.38 116.59,16.38 117.35,15.62 117.35,9.4 117.28,9.34 | IC16.12 117.28,9.34 | IC19.12 134.24,7.62 133.1,8.76 126.36,8.76 125.73,8.13 118.49,8.13 117.28,9.34 | v134.24,39.37 133.1,38.23 v128.02,38.23
D3
  Bottom 0.254: IC6.15 6.35,15.24 BUS2.21
D3B  (via drill 0.61)
  Top 0.254: IC18.15 138.56,48.13 v134.37,48.13 134.37,44.58 132.84,43.05 131.06,43.05 130.3,42.29 v130.3,34.29 | JP3.5 IC6.5 | v120.14,6.48 v122.68,6.48 | v137.67,22.23 137.67,17.27 IC19.15
  Bottom 0.254: IC15.15 129.92,46.99 131.06,48.13 v134.37,48.13 | IC12.15 94.87,15.24 96.27,13.84 97.03,13.84 97.92,12.95 97.92,9.65 97.98,9.59 | 97.98,9.59 98.55,9.02 109.35,9.02 110.68,10.35 | IC16.15 110.68,10.35 | IC19.15 139.7,14.86 141.48,13.08 141.48,7.24 140.72,6.48 v122.68,6.48 | v120.14,6.48 114.55,6.48 110.68,10.35 | JP3.5 56.26,12.7 57.4,13.84 59.44,13.84 60.2,13.08 60.2,7.24 59.18,6.22 57.4,6.22 56.64,5.46 56.64,4.7 57.4,3.94 83.06,3.94 88.14,9.02 97.41,9.02 97.98,9.59 | v130.3,34.29 130.3,33.02 136.27,27.05 136.27,23.62 v137.67,22.23
D4
  Top 0.254: IC6.14 6.35,17.78 BUS2.19
D4B  (via drill 0.61)
  Top 0.254: JP3.6 IC6.6 | v128.65,17.78 124.21,22.23 120.27,22.23 117.35,25.15 117.35,25.78 116.59,26.54 114.43,26.54 | 114.43,26.54 109.35,21.46 106.93,21.46 106.17,20.7 106.17,19.56 IC16.5 | v60.45,22.23 61.98,22.23 65.28,18.92 75.82,18.92 76.96,17.78 IC12.5 | IC15.5 115.57,49.15 112.9,46.48 v112.9,37.59 | v112.52,29.08 112.52,28.45 114.43,26.54
  Bottom 0.254: IC15.5 121.03,49.53 122.17,48.39 130.56,48.39 131.7,49.53 IC18.5 | IC12.5 81.28,18.16 79.5,19.94 79.5,20.7 80.52,21.72 85.6,21.72 87.88,24 101.73,24 IC16.5 | v128.65,17.78 IC19.5 | JP3.6 48.39,15.24 54.86,21.72 59.94,21.72 v60.45,22.23 | v112.9,37.59 112.9,29.46 v112.52,29.08
D5
  Top 0.254: IC6.13 6.35,20.32 BUS2.17
D5B  (via drill 0.61)
  Top 0.254: JP3.7 IC6.7 | v102.11,21.46 106.93,16.64 112.27,16.64 113.41,17.78 IC16.16 | v62.23,24 71.5,24 76.58,18.92 83.82,18.92 v85.34,20.45 | IC18.16 134.24,49.53 132.84,48.13 131.06,48.13 129.41,46.48 v129.41,35.31
  Bottom 0.254: IC15.16 124.84,49.53 131.06,55.75 133.48,55.75 IC18.16 | IC12.16 88.9,18.16 87.12,19.94 87.12,20.45 | 87.12,20.45 87.12,20.7 87.88,21.46 v102.11,21.46 | IC19.16 139.32,17.78 133.67,23.43 | 133.67,23.43 133.1,24 118.87,24 116.33,21.46 114.55,21.46 113.79,20.7 113.79,19.56 IC16.16 | JP3.7 48.64,17.78 54.86,24 v62.23,24 | 87.12,20.45 v85.34,20.45 | v129.41,35.31 129.41,33.15 135.13,27.43 135.13,24.89 133.67,23.43
D6
  Bottom 0.254: IC6.12 23.75,22.86 18.8,17.91 10.41,17.91 7.87,20.45 6.22,20.45 BUS2.15
D6B  (via drill 0.61)
  Top 0.254: IC6.8 JP3.8 53.72,20.32 57.4,16.64 v61.98,16.64 | v110.24,24.26 109.09,24.26 IC16.2 | IC15.2 115.57,56.77 111.63,52.83 v111.63,37.08
  Bottom 0.254: IC15.2 115.57,56.77 113.79,54.99 113.79,51.69 114.55,50.93 125.48,50.93 131.7,57.15 IC18.2 | IC19.2 117.73,25.4 116.59,24.26 v110.24,24.26 | v61.98,16.64 61.98,20.95 65.28,24.26 69.98,24.26 71.88,26.16 80.52,26.16 IC12.2 86.74,25.4 87.88,26.54 106.81,26.54 IC16.2 107.82,25.65 111.63,29.46 v111.63,37.08
D7
  Top 0.254: IC6.11 30.73,25.4 28.32,22.99 11.43,22.99 9.14,25.27 6.22,25.27 BUS2.13
D7B  (via drill 0.61)
  Top 0.254: JP3.9 IC6.9 | v105.79,25.4 106.93,26.54 v113.16,26.54 | v134.24,25.4 IC19.19 | v61.34,28.96 64.9,28.96 65.02,29.08 68.96,29.08 69.98,28.07 69.98,27.56 v72.26,25.27
  Bottom 0.254: IC15.19 124.21,57.15 125.35,56.01 128.78,56.01 131.06,58.29 138.56,58.29 IC18.19 147.45,49.4 147.45,45.47 150.24,42.67 150.24,31.75 147.57,29.08 138.68,29.08 137.92,28.32 137.92,27.18 IC19.19 | v105.79,25.4 IC12.19 88.52,25.4 87.38,24.26 80.26,24.26 79.25,25.27 v72.26,25.27 | v113.16,26.54 114.43,26.54 IC16.19 115.57,25.53 116.59,26.54 133.1,26.54 v134.24,25.4 | JP3.9 51.82,27.69 51.82,31.5 52.32,32 58.29,32 v61.34,28.96
D8
  Top 0.254: IC5.9 33.53,38.1 26.16,30.73 26.16,29.97 29.08,27.05 29.08,26.29 28.32,25.53 10.41,25.53 8.13,27.81 6.22,27.81 BUS2.11
D8B
  Top 0.254: JP2.2 IC5.11
D9  (via drill 0.61)
  Top 0.254: v14.22,59.82 13.84,59.82 v10.92,62.74
  Bottom 0.254: IC5.8 35.94,40.64 42.42,47.12 44.2,47.12 44.96,47.88 44.96,51.18 43.94,52.2 40.39,52.2 37.85,54.74 37.85,59.05 36.83,60.07 28.57,60.07 28.32,59.82 v14.22,59.82 | v10.92,62.74 9.78,62.74 7.87,60.83 7.11,60.83 6.22,59.94 6.22,59.18 5.33,58.29 4.57,58.29 2.03,55.75 2.03,32.26 BUS2.9
D9B
  Top 0.254: JP2.3 IC5.12
D10  (via drill 0.61)
  Top 0.254: v13.72,27.69 v24.77,38.73
  Bottom 0.254: IC5.7 34.67,43.18 30.23,38.73 v24.77,38.73 | v13.72,27.69 12.95,27.69 10.03,24.77 10.03,23.62 9.4,22.99 7.11,22.99 6.22,23.88 6.22,30.61 BUS2.7
D10B
  Top 0.254: JP2.4 IC5.13
D11  (via drill 0.61)
  Top 0.254: IC5.6 35.56,46.1 37.34,47.88 37.34,48.64 36.58,49.4 31.24,49.4 26.16,44.32 24.38,44.32 20.07,40.01 20.07,39.88 16.89,36.7 v9.14,36.7
  Bottom 0.254: v9.14,36.7 7.87,35.43 6.99,35.43 5.84,34.29 BUS2.5
D11B
  Top 0.254: JP2.5 IC5.14
D12
  Top 0.254: IC5.5 30.99,48.26 27.18,44.45 27.18,42.8 26.16,41.78 22.73,41.78 16.64,35.69 6.22,35.69 BUS2.3
D12B
  Top 0.254: JP2.6 IC5.15
D13
  Top 0.254: IC5.4 30.1,50.8 26.16,46.86 24.38,46.86 19.56,42.04 19.56,40.13 17.27,37.85 8.26,37.85 7.87,38.23 6.22,38.23 BUS2.1
D13B
  Top 0.254: JP2.7 IC5.16
D14  (via drill 0.61)
  Top 0.254: IC5.3 27.56,53.34 26.42,54.48 23.62,54.48 v20.45,51.31
  Bottom 0.254: v20.45,51.31 18.54,49.4 14.22,49.4 7.87,43.05 6.22,43.05 BUS1.39
D14B
  Top 0.254: JP2.8 IC5.17
D15
  Bottom 0.254: IC5.2 35.56,56.26 37.34,58.04 37.34,58.8 36.58,59.56 31.24,59.56 26.16,54.48 16.76,54.48 7.87,45.59 6.22,45.59 BUS1.37
D15B
  Top 0.254: JP2.9 IC5.18
FC0
  Top 0.254: IC4.3 27.56,81.28 26.16,79.88 9.14,79.88 7.87,78.61 7.11,78.61 6.22,77.72 6.22,71.88 5.33,70.99 4.57,70.99 3.94,70.36 3.94,68.45 BUS1.19
FC0B  (via drill 0.61)
  Top 0.254: JP1.7 IC4.17 | v51.44,83.06 51.44,87.25 v52.58,88.39
  Bottom 0.254: IC13.19 108.46,58.93 108.46,61.98 97.92,72.52 97.92,79.5 92.46,84.96 90.68,84.96 89.66,85.98 89.66,87.76 83.82,93.6 IC10.1 83.82,93.47 83.19,92.84 57.66,92.84 53.21,88.39 v52.58,88.39 | JP1.7 51.31,83.06 v51.44,83.06
FC1
  Bottom 0.254: IC4.4 31.62,78.74 30.1,77.22 28.57,77.22 26.16,74.8 24.38,74.8 15.49,65.91 6.22,65.91 BUS1.21
FC1B  (via drill 0.61)
  Top 0.254: JP1.6 IC4.16 | v70.87,78.49 IC10.2 | IC13.18 106.68,54.99 104.14,57.53 104.14,60.71 v96.9,67.94
  Bottom 0.254: v70.87,78.49 69.98,77.6 61.72,77.6 59.44,79.88 50.67,79.88 JP1.6 | v96.9,67.94 96.9,77.98 92.2,82.68 90.42,82.68 89.15,83.95 89.15,86.11 IC10.2
FC2
  Bottom 0.254: IC4.5 30.48,76.2 26.54,72.26 22.61,72.26 13.97,63.63 6.48,63.63 BUS1.23
FC2B  (via drill 0.61)
  Top 0.254: JP1.5 IC4.15 | IC13.17 103.63,55.12 103.63,59.31 96.01,66.93 96.01,68.33 100.2,72.52 100.2,91.95 99.57,92.58 90.42,92.58 86.74,88.9 IC10.3 70.61,75.69 v70.61,74.55
  Bottom 0.254: JP1.5 56.26,73.66 57.4,72.52 69.85,72.52 70.61,73.28 v70.61,74.55
GND  (via drill 0.61)
  Top 0.406: IC17.8 132.08,73.66 137.16,68.58 C18.2 | C7.2 64.39,96.52 65.66,97.79 77.47,97.79 JP8.3 79.25,97.03 88.9,97.03 C10.2 | v108.46,66.55 C13.2 | C20.- 33.4,92.71 32.26,91.57 28.07,91.57 C1.2 IC1.19 25.27,91.31 25.27,91.06 23.62,89.41 23.62,83.31 24.26,82.68 32.13,82.68 34.42,84.96 42.04,84.96 IC4.19 45.72,83.82 46.35,84.45 | v77.85,65.66 79.12,64.39 | 79.12,64.39 C11.2 87.76,58.55 v88.14,58.55 | IC5.19 44.45,55.88 45.85,57.28 47.12,57.28 C5.2 | C2.2 IC2.19 | C4.2 46.35,84.45 | 46.35,84.45 49.02,81.79 49.02,80.01 57.91,71.12 IC7.10 60.71,68.83 70.1,68.83 76.2,62.74 77.47,62.74 79.12,64.39 | IC16.10 112.9,5.08 114.05,3.94 130.94,3.94 IC19.10 | SWR4.5 144.53,15.24 140.59,11.3 138.3,11.3 IC19.10 | SWR2.5 141.99,36.83 140.84,37.97 133.22,37.97 IC18.10 | 93.98,29.72 93.98,31.75 IC13.10 99.19,36.96 103.63,36.96 104.65,37.97 109.35,37.97 111.25,36.07 114.81,36.07 IC15.10 | 93.98,29.72 C12.2 | C19.2 132.21,30.48 130.68,32 124.71,32 C16.2 v120.65,23.11 120.78,22.99 124.84,22.99 129.67,18.16 129.67,7.75 132.08,5.33 IC19.10 | SWR1.5 91.19,15.24 89.79,13.84 87.76,13.84 87.12,13.21 87.12,12.19 88.01,11.3 90.04,11.3 90.68,10.67 90.68,9.65 89.79,8.76 84.96,8.76 IC12.10 | C3.2 IC3.19 | 81.41,29.72 72.9,29.72 C9.2 | 81.41,29.72 93.98,29.72 | 81.41,29.72 v81.41,34.8
  Bottom 0.406: 137.16,88.77 137.16,87.88 138.81,86.23 142.37,86.23 TOGLDEP.5 | 137.16,88.77 137.16,93.85 | 137.16,93.85 C17.2 | C15.2 130.81,62.23 C18.2 138.3,61.09 140.59,61.09 141.99,59.69 TOGLSTP.5 | TOGL3.5 123.19,84.33 124.46,83.06 | 124.46,83.06 124.46,82.04 125.22,81.28 126.24,81.28 130.3,77.22 130.3,76.71 IC17.8 | 137.16,88.77 130.94,88.77 127,84.84 127,84.58 126.24,83.82 125.22,83.82 124.46,83.06 | JP8.3 JP8.1 | v108.46,66.55 108.46,74.17 IC14.8 111,76.71 111,81.28 114.3,84.58 114.3,93.85 | 114.3,93.85 C14.2 114.17,95.38 91.57,95.38 89.92,97.03 89.03,97.03 C10.2 | 114.3,93.85 137.16,93.85 | C6.2 24.38,2.54 23.11,3.81 IC3.10 17.65,3.94 10.03,3.94 1.4,12.57 1.4,70.48 4.57,73.66 12.45,73.66 13.97,75.18 | IC1.10 17.78,71.37 13.97,75.18 | 13.97,75.18 13.97,77.98 11.81,80.14 | 11.81,80.14 8.13,83.82 6.35,83.82 BUS1.5 | IC1.19 25.15,91.44 18.67,84.96 16.64,84.96 11.81,80.14 | C11.2 85.22,56.01 85.22,43.56 81.28,39.62 IC11.7 81.41,39.24 v81.41,34.8 | C8.2 71.12,60.07 77.28,66.23 | 77.28,66.23 82.17,71.12 IC10.10 | 77.28,66.23 v77.85,65.66 | IC4.10 31.88,63.5 29.34,60.96 C2.2 | IC4.10 IC5.19 | IC7.10 57.91,71.12 56.64,72.39 45.72,72.39 44.96,71.63 44.96,70.61 44.32,69.98 42.29,69.98 35.81,63.5 IC4.10 | C19.2 137.16,31.75 IC18.10 | IC15.10 115.57,33.02 C16.2 | SWR3.5 121.92,16 120.65,17.27 v120.65,23.11 | 60.96,5.08 63.75,5.08 64.9,6.22 80.14,6.22 IC12.10 | 60.96,5.08 IC9.10 | 64.9,26.8 58.42,33.27 IC8.10 45.72,34.29 41.27,29.84 | 64.9,26.8 69.98,26.8 C9.2 | IC6.10 43.18,27.94 41.27,29.84 | 41.27,29.84 IC5.10 35.43,35.69 29.08,35.69 | IC2.10 21.46,40.64 26.42,35.69 29.08,35.69 | C3.2 27.94,25.02 29.08,26.16 29.08,35.69
  Bottom 0.406: 60.96,5.08 60.96,21.34 64.26,24.64 64.26,26.16 64.9,26.8 | C13.2 91.82,62.23 v88.14,58.55
LDSINV  (via drill 0.61)
  Top 0.254: IC10.15 v87.76,84.96
  Bottom 0.254: IC7.2 63.88,91.44 65.28,90.04 77.98,90.04 83.06,84.96 v87.76,84.96
N$1
  Top 0.254: JP4.8 IC7.19
N$2  (via drill 0.61)
  Top 0.254: IC11.3 83.82,46.99 IC11.11 90.04,45.85 107.7,45.85 108.97,47.12 108.97,50.93 113.54,55.5 v113.54,56.01
  Bottom 0.254: IC11.5 81.28,44.83 79.5,46.61 79.5,47.75 IC11.3 81.15,49.53 79.5,51.18 79.5,52.45 81.28,54.23 IC11.1 | NMI.2 114.3,65.41 113.54,64.64 v113.54,56.01
N$3
  Top 0.254: JP5.8 IC8.19
N$4
  Top 0.254: JP4.7 IC7.18
N$5
  Top 0.254: IC15.18 125.86,54.61 129.29,58.04 129.29,82.3 IC17.4
N$6
  Top 0.254: IC14.7 112.14,77.47 118.49,71.12 STP.3
N$7
  Top 0.254: JP4.6 IC7.17
N$8
  Top 0.254: IC15.17 124.08,52.07 129.79,57.78 129.79,75.06 132.08,77.34 IC17.7
N$9  (via drill 0.61)
  Top 0.254: IC15.14 123.19,44.83 130.3,51.94 130.3,63.63 v135.51,68.83 | v136.91,70.23 136.91,82.3 IC17.13
  Bottom 0.254: v136.91,70.23 v135.51,68.83
N$10
  Top 0.254: IC15.13 123.19,42.29 130.3,49.4 130.3,49.91 131.32,50.93 133.1,50.93 137.92,55.75 137.92,61.47 138.56,62.1 138.56,73.79 IC17.9
N$11
  Bottom 0.254: IC15.3 115.57,54.99 117.35,56.77 117.35,66.93 115.44,68.83 115.44,74.17 115.06,74.55 115.06,83.31 IC14.13
N$12
  Bottom 0.254: IC15.4 115.57,52.45 117.98,54.86 117.98,73.79 IC14.9
N$13
  Bottom 0.254: IC14.4 109.22,84.71 107.44,82.93 107.44,64.52 112.65,59.31 112.65,47.37 IC15.7
N$14
  Top 0.254: JP4.5 IC7.16
N$15
  Top 0.254: JP4.4 IC7.15
N$16
  Top 0.254: JP4.3 IC7.14
N$17
  Top 0.254: JP4.2 IC7.13
N$21
  Top 0.254: JP4.1 IC7.12
N$22
  Top 0.254: JP5.7 IC8.18
N$23
  Top 0.254: JP5.6 IC8.17
N$24
  Top 0.254: JP5.5 IC8.16
N$25
  Top 0.254: JP5.4 IC8.15
N$26
  Top 0.254: JP5.3 IC8.14
N$27
  Top 0.254: JP5.2 IC8.13
N$28
  Top 0.254: JP5.1 IC8.12
N$29
  Top 0.254: JP6.8 IC9.19
N$30
  Top 0.254: JP6.7 IC9.18
N$31
  Top 0.254: JP6.6 IC9.17
N$32
  Top 0.254: JP6.5 IC9.16
N$33
  Top 0.254: JP6.4 IC9.15
N$34
  Top 0.254: JP6.3 IC9.14
N$35
  Top 0.254: JP6.2 IC9.13
N$36
  Top 0.254: JP6.1 IC9.12
ODDLOW
  Top 0.254: IC13.15 106.68,47.37 108.46,49.15 108.46,57.4 110.74,59.69 110.74,66.42 102.74,74.42 102.74,82.68 JP9.5
R/!W
  Top 0.254: BUS2.20 IC3.9
R/!WB
  Top 0.254: IC3.11 27.69,3.81 30.1,1.4 45.85,1.4 JP3.1
S00
  Top 0.254: IC12.8 81.28,10.54 85.34,14.61 85.34,18.41 87.12,20.19 87.12,20.7 87.88,21.46 95.38,21.46 SWR1.1
S01
  Bottom 0.254: IC12.7 84.2,12.7 88.14,16.64 95.38,16.64 SWR1.3
S02
  Top 0.254: IC12.13 88.27,10.16 85.85,12.57 85.85,18.16 86.87,19.18 97.92,19.18 SWR1.2
S03
  Top 0.254: IC12.14 94.87,12.7 96.27,14.1 97.03,14.1 97.92,14.99 97.92,15.75 99.06,16.89 SWR1.4
S04  (via drill 0.61)
  Top 0.254: v86.74,17.78 88.01,16.51 v97.41,16.51
  Bottom 0.254: IC12.4 82.68,20.32 83.06,20.7 83.82,20.7 v86.74,17.78 | v97.41,16.51 97.41,16 97.92,15.49 97.92,13.84 SWR1.8
S05
  Bottom 0.254: IC12.17 94.87,20.32 96.27,18.92 97.03,18.92 97.92,18.03 97.92,17.27 98.81,16.38 99.57,16.38 100.2,15.75 100.2,11.3 SWR1.10
S06
  Bottom 0.254: IC12.3 80.9,22.86 78.99,20.95 78.99,12.83 80.26,11.56 95.38,11.56 SWR1.7
S07
  Top 0.254: IC12.18 98.17,22.86 100.2,20.83 100.2,12.19 99.31,11.3 97.79,11.3 96.65,10.16 SWR1.9
S08
  Top 0.254: IC18.8 137.54,41.91 138.68,43.05 144.91,43.05 SWR2.1
S09
  Bottom 0.254: IC18.7 135,44.45 138.94,40.51 144.91,40.51 SWR2.3
S10
  Top 0.254: IC18.13 144.4,41.91 145.54,40.77 147.45,40.77 SWR2.2
S11
  Bottom 0.254: IC18.14 145.16,44.45 147.45,42.16 147.45,40.51 SWR2.4
S12
  Bottom 0.254: IC18.4 132.46,52.07 138.94,45.59 146.56,45.59 149.73,42.42 149.73,35.43 SWR2.8
S13  (via drill 0.61)
  Top 0.254: IC18.17 139.7,51.69 141.48,49.91 141.48,46.61 140.46,45.59 138.18,45.59 v135.38,42.8
  Bottom 0.254: v135.38,42.8 135.38,41.53 138.94,37.97 140.72,37.97 145.8,32.89 147.45,32.89 SWR2.10
S14
  Bottom 0.254: IC18.3 132.08,54.23 130.3,52.45 130.3,51.69 131.32,50.67 133.1,50.67 137.92,45.85 137.92,44.07 138.94,43.05 143.26,43.05 145.8,40.51 146.56,40.51 147.19,39.88 147.19,35.43 SWR2.7
S15
  Top 0.254: IC18.18 139.7,54.23 144.91,49.02 144.91,46.99 148.84,43.05 149.1,43.05 149.73,42.42 149.73,38.86 148.84,37.97 148.08,37.97 147.19,37.08 147.19,32.89 SWR2.9
S16  (via drill 0.61)
  Top 0.254: v113.28,14.22 114.43,14.22 114.55,14.1 119.13,14.1 121.67,16.64 122.43,16.64 123.06,17.27 123.06,19.18 SWR3.1
  Bottom 0.254: IC16.8 109.22,10.16 v113.28,14.22
S17
  Top 0.254: IC16.7 109.09,12.7 113.03,16.64 120.78,16.64 SWR3.3
S18  (via drill 0.61)
  Top 0.254: IC16.13 120.27,10.16 121.67,11.56 122.43,11.56 123.32,12.45 123.32,13.72 v123.57,13.97
  Bottom 0.254: v123.57,13.97 123.57,14.48 123.32,14.73 123.32,19.18 SWR3.2
S19
  Top 0.254: IC16.14 120.27,12.7 121.67,14.1 122.43,14.1 123.32,14.99 123.32,16.64 SWR3.4
S20  (via drill 0.61)
  Top 0.254: IC16.4 110.87,20.32 114.55,24 116.59,24 v119.63,20.95
  Bottom 0.254: v119.63,20.95 119.63,15.88 121.67,13.84 122.43,13.84 123.57,12.7 SWR3.8
S21
  Bottom 0.254: IC16.17 116.2,20.32 119.13,17.4 119.13,13.84 121.67,11.3 123.32,11.3 SWR3.10
S22  (via drill 0.61)
  Top 0.254: v111.89,14.22 114.55,11.56 120.78,11.56 SWR3.7
  Bottom 0.254: IC16.3 107.95,22.48 111.89,18.54 v111.89,14.22
S23  (via drill 0.61)
  Top 0.254: IC16.18 115.57,22.48 117.73,20.32 v117.73,17.53
  Bottom 0.254: v117.73,17.53 117.73,16 118.62,15.11 118.62,13.46 SWR3.9
S24
  Top 0.254: IC19.8 135,10.16 138.94,14.1 140.72,14.1 146.05,19.43 SWR4.1
S25  (via drill 0.61)
  Top 0.254: IC19.7 132.08,13.08 136.4,17.4 v136.4,21.97
  Bottom 0.254: v136.4,21.97 136.65,21.97 137.29,21.34 138.56,21.34 138.68,21.46 142.37,21.46 SWR4.3
S26
  Top 0.254: IC19.13 138.18,10.16 137.29,9.27 137.29,7.87 138.68,6.48 145.92,6.48 148.46,9.02 149.1,9.02 150.24,10.16 150.24,18.67 SWR4.2
S27
  Top 0.254: IC19.14 141.1,12.7 145.03,16.64 147.45,16.64 SWR4.4
S28  (via drill 0.61)
  Top 0.254: v138.18,8.89 146.43,8.89 147.45,9.91 147.45,10.79 148.59,11.94 SWR4.8
  Bottom 0.254: IC19.4 132.08,19.94 137.92,14.1 137.92,9.14 v138.18,8.89
S29
  Bottom 0.254: IC19.17 139.7,19.94 145.8,13.84 146.56,13.84 147.45,12.95 147.45,11.3 SWR4.10
S30
  Bottom 0.254: IC19.3 132.46,22.86 138.94,16.38 142.37,16.38 SWR4.7
S31
  Top 0.254: IC19.18 145.16,22.86 147.45,20.57 147.45,19.81 148.34,18.92 149.1,18.92 149.73,18.29 149.73,14.73 148.84,13.84 148.08,13.84 147.19,12.95 147.19,11.3 SWR4.9
SW_CYC
  Top 0.254: TOGLSTP.4 148.59,63.12 149.73,64.26 149.73,69.98 C/S.1
T_AD
  Bottom 0.254: IC17.5 137.54,82.55 138.94,81.15 147.45,81.15 TOGLDEP.8
T_CONT
  Top 0.254: IC14.1 114.68,92.71 116.08,91.31 124.59,91.31 TOGL3.2
T_DEP
  Top 0.254: IC17.1 133.1,92.71 136.78,96.39 140.08,96.39 148.59,87.88 TOGLDEP.2
T_EXM
  Top 0.254: IC17.10 139.7,77.85 145.8,83.95 147.45,83.95 TOGLDEP.4
T_HLT
  Top 0.254: H/R.1 146.05,52.07 TOGLSTP.10
T_LOAD
  Top 0.254: IC14.14 116.84,87.25 122.94,81.15 124.59,81.15 TOGL3.10
T_MR
  Bottom 0.254: IC17.14 141.86,87.63 145.8,83.69 146.56,83.69 147.45,82.8 147.45,82.04 148.34,81.15 149.1,81.15 149.73,80.52 149.73,78.61 TOGLDEP.10
T_RST
  Top 0.254: H/R.2 148.59,52.96 149.73,54.1 149.73,56.01 TOGLSTP.8
T_RUN
  Bottom 0.254: IC14.10 116.84,77.85 122.05,83.06 122.05,85.6 122.94,86.49 124.59,86.49 TOGL3.4
T_STP_NC  (via drill 0.61)
  Top 0.254: IC14.6 112.14,80.01 116.08,76.07 v127,76.07
  Bottom 0.254: v127,76.07 138.3,64.77 TOGLSTP.1
T_STP_NO  (via drill 0.61)
  Top 0.254: IC14.5 112.14,82.55 116.08,78.61 v119.51,78.61
  Bottom 0.254: v119.51,78.61 126.24,78.61 133.73,71.12 C/S.2 148.59,68.58 TOGLSTP.2
VCC  (via drill 0.61)
  Top 0.406: SWR3.6 125.73,13.97 125.73,12.19 124.97,11.43 123.95,11.43 123.19,10.67 123.19,9.65 121.54,8 120.27,8 117.35,5.08 IC16.11 115.44,5.21 113.79,5.21 112.52,6.48 101.09,6.48 | C6.1 IC6.20 35.69,2.67 41.02,2.67 42.16,3.81 49.02,3.81 50.04,2.79 v86.61,2.79 | IC12.11 89.66,5.08 94.74,10.16 | 94.74,10.16 96.01,11.43 97.03,11.43 97.79,12.19 97.79,13.97 SWR1.6 | 101.09,6.48 98.42,6.48 94.74,10.16 | IC3.20 IC3.1 | IC3.20 C3.1 | IC8.20 C8.1 68.71,57.02 68.96,57.02 80.14,45.85 v86.23,45.85 | C5.1 IC5.20 IC5.1 35.43,58.55 34.42,58.55 29.46,63.5 C2.1 | v27.18,39.62 25.53,37.97 25.53,26.8 IC3.20 | C11.1 IC11.14 | IC13.20 C13.1 v108.97,64.52 | C9.1 IC9.20 | C12.1 IC12.20 | 123.19,33.27 123.19,33.02 C16.1 IC16.20 113.41,30.1 107.82,30.1 101.09,23.37 101.09,6.48 | 123.19,33.27 IC15.11 | C19.1 IC19.20 | C19.1 139.7,33.27 | 139.7,33.27 IC18.11 | C19.1 149.1,30.48 149.86,31.24 149.86,34.8 148.59,36.07 SWR2.6 150.37,38.61 150.37,57.91 TOGLSTP.6 147.83,59.69 146.56,60.96 | 139.7,33.27 123.19,33.27 | C4.1 IC4.20 IC4.1 v35.56,89.28 | BUS1.1 5.84,90.17 9.53,93.85 17.65,93.85 IC1.1 IC1.20 C1.1 29.21,95.25 C20.+ | 91.44,96.39 91.44,97.03 C10.1 | 91.44,96.39 91.44,95.25 | 91.44,95.25 IC10.20 | C7.1 66.04,95.25 | 66.04,95.25 IC7.20 | JP8.4 76.2,95.25 | 76.2,95.25 JP8.2 | 76.2,95.25 66.04,95.25 | 76.2,95.25 91.44,95.25 | C15.1 IC15.20 | C18.1 139.7,60.96 | 139.7,60.96 IC18.20 | 139.7,60.96 146.56,60.96 | C17.1 IC17.16 139.57,92.58 134.24,92.58 132.97,91.31 127.64,91.31 127,90.68 | TOGL3.6 125.73,85.85 127,87.12 127,90.68 | 127,90.68 125.09,92.58 116.97,92.58 IC14.16 C14.1 115.7,96.39 91.44,96.39 | 146.56,60.96 147.32,61.72 147.32,81.28 TOGLDEP.6
  Bottom 0.406: IC12.11 v86.61,2.79 | IC2.1 18.8,63.5 19.56,64.26 24.64,64.26 IC2.20 C2.1 | IC8.20 60.71,57.15 58.29,59.56 46.86,59.56 C5.1 | v27.18,39.62 27.18,41.15 26.29,42.04 24.26,42.04 23.62,42.67 23.62,51.31 24.51,52.2 29.34,52.2 IC5.1 | C11.1 89.53,57.15 90.93,58.55 100.71,58.55 101.85,59.69 IC13.20 | C9.1 69.47,27.94 70.61,29.08 77.85,29.08 80.14,26.8 87.25,26.8 88.39,27.94 IC12.20 88.27,28.07 86.49,29.84 86.49,45.85 | IC11.14 88.39,54.61 86.49,52.7 86.49,45.85 | IC19.11 144.53,5.08 148.34,8.89 149.1,8.89 149.86,9.65 149.86,13.97 SWR4.6 148.46,15.37 148.46,16.13 147.32,17.27 147.32,20.83 140.21,27.94 IC19.20 | 35.56,93.98 v35.56,89.28 | C20.+ 35.56,93.98 | C15.1 127.25,59.69 130.94,63.37 138.56,63.37 C18.1 | TOGLDEP.6 148.59,83.31 147.32,84.58 147.32,85.6 146.56,86.36 145.54,86.36 141.48,90.42 141.48,90.93 IC17.16 | IC14.16 115.06,90.93 115.06,84.33 111.76,81.03 NMI.3 111.63,69.72 111.63,68.33 108.97,65.66 v108.97,64.52 | C7.1 64.9,97.66 45.09,97.66 41.53,94.11 35.69,94.11 35.56,93.98 | v86.23,45.85 86.49,45.85

## Text on the board
tNames: +5V | 1 | 1 | S | C | CONSOLE BUS BUFFERING - ADDRESS DECODER / ADDRESS LEDS - SWR & CONTROL TOGGLES / IPL LEVEL 7 - DTACK GENERATION | 3 | 2 | 1 | 1 | H | R | 1 | 68010 FRONT PANEL PCB#1 | JLCJLCJLCJLC | 1 | 1 | 1 | + | 6-2021 | PA8PDP